# Altium schematic sheet CW342_FPGA_PWR.SchDoc: <Enter Sheet Title>
size Letter; Organization: NewAE Technology Inc.; Address1: 1083 Queen St., Suite 196; Address2: Halifax; Address3: NS; Address4: Canada B3H 0B2; SheetNumber: 8; SheetTotal: 9; SheetApproved: NO
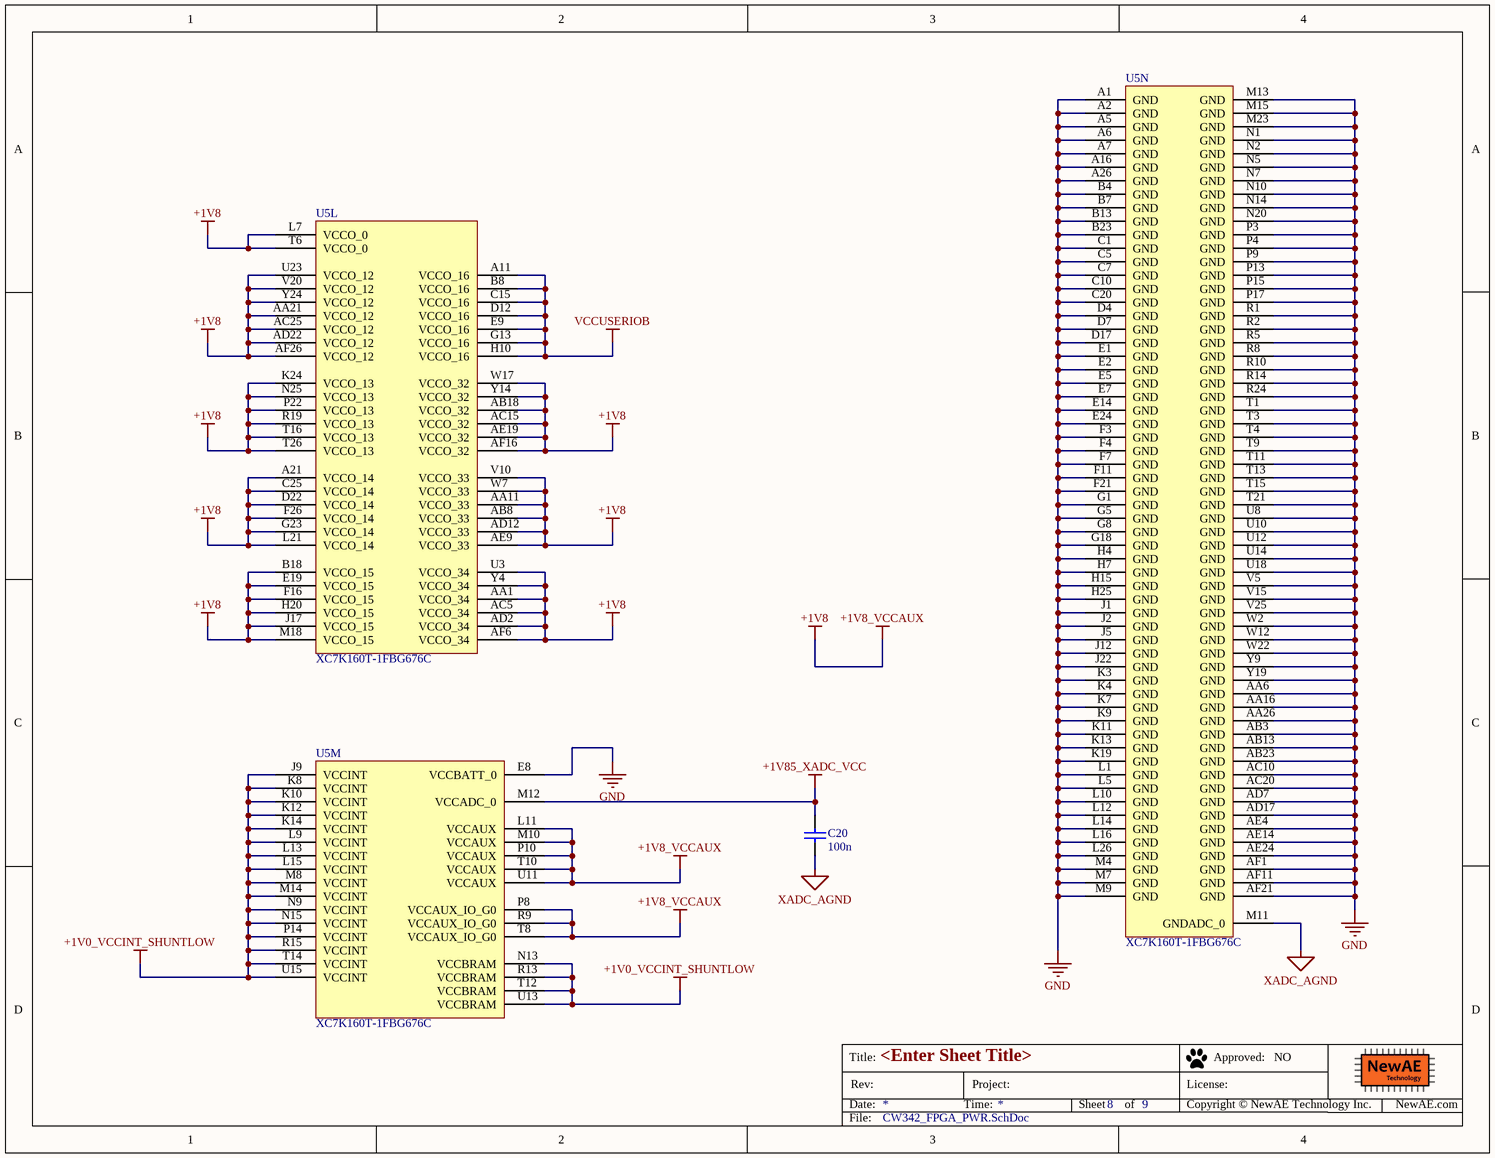
[diagram p0: CW342_FPGA_PWR.SchDoc]

## Parts
C20  100n  [CAPC0402_M]
U5  XC7K160T-1FBG676C  [FBG676]  (parts L,M,N of 14)

## Nets
+1V0_VCCINT_SHUNTLOW: U5.J9(VCCINT) U5.K8(VCCINT) U5.K10(VCCINT) U5.K12(VCCINT) U5.K14(VCCINT) U5.L9(VCCINT) U5.L13(VCCINT) U5.L15(VCCINT) U5.M8(VCCINT) U5.M14(VCCINT) U5.N9(VCCINT) U5.N13(VCCBRAM) U5.N15(VCCINT) U5.P14(VCCINT) U5.R13(VCCBRAM) U5.R15(VCCINT) U5.T12(VCCBRAM) U5.T14(VCCINT) U5.U13(VCCBRAM) U5.U15(VCCINT)
+1V8: U5.A21(VCCO_14) U5.AA1(VCCO_34) U5.AA11(VCCO_33) U5.AA21(VCCO_12) U5.AB8(VCCO_33) U5.AB18(VCCO_32) U5.AC5(VCCO_34) U5.AC15(VCCO_32) U5.AC25(VCCO_12) U5.AD2(VCCO_34) U5.AD12(VCCO_33) U5.AD22(VCCO_12) U5.AE9(VCCO_33) U5.AE19(VCCO_32) U5.AF6(VCCO_34) U5.AF16(VCCO_32) U5.AF26(VCCO_12) U5.B18(VCCO_15) U5.C25(VCCO_14) U5.D22(VCCO_14) U5.E19(VCCO_15) U5.F16(VCCO_15) U5.F26(VCCO_14) U5.G23(VCCO_14) U5.H20(VCCO_15) U5.J17(VCCO_15) U5.K24(VCCO_13) U5.L7(VCCO_0) U5.L11(VCCAUX) U5.L21(VCCO_14) U5.M10(VCCAUX) U5.M18(VCCO_15) U5.N25(VCCO_13) U5.P8(VCCAUX_IO_G0) U5.P10(VCCAUX) U5.P22(VCCO_13) U5.R9(VCCAUX_IO_G0) U5.R19(VCCO_13) U5.T6(VCCO_0) U5.T8(VCCAUX_IO_G0) U5.T10(VCCAUX) U5.T16(VCCO_13) U5.T26(VCCO_13) U5.U3(VCCO_34) U5.U11(VCCAUX) U5.U23(VCCO_12) U5.V10(VCCO_33) U5.V20(VCCO_12) U5.W7(VCCO_33) U5.W17(VCCO_32) U5.Y4(VCCO_34) U5.Y14(VCCO_32) U5.Y24(VCCO_12)  [also labelled +1V8_VCCAUX]
+1V85_XADC_VCC: C20.1 U5.M12(VCCADC_0)
GND: U5.A1(GND) U5.A2(GND) U5.A5(GND) U5.A6(GND) U5.A7(GND) U5.A16(GND) U5.A26(GND) U5.AA6(GND) U5.AA16(GND) U5.AA26(GND) U5.AB3(GND) U5.AB13(GND) U5.AB23(GND) U5.AC10(GND) U5.AC20(GND) U5.AD7(GND) U5.AD17(GND) U5.AE4(GND) U5.AE14(GND) U5.AE24(GND) U5.AF1(GND) U5.AF11(GND) U5.AF21(GND) U5.B4(GND) U5.B7(GND) U5.B13(GND) U5.B23(GND) U5.C1(GND) U5.C5(GND) U5.C7(GND) U5.C10(GND) U5.C20(GND) U5.D4(GND) U5.D7(GND) U5.D17(GND) U5.E1(GND) U5.E2(GND) U5.E5(GND) U5.E7(GND) U5.E8(VCCBATT_0) U5.E14(GND) U5.E24(GND) U5.F3(GND) U5.F4(GND) U5.F7(GND) U5.F11(GND) U5.F21(GND) U5.G1(GND) U5.G5(GND) U5.G8(GND) U5.G18(GND) U5.H4(GND) U5.H7(GND) U5.H15(GND) U5.H25(GND) U5.J1(GND) U5.J2(GND) U5.J5(GND) U5.J12(GND) U5.J22(GND) U5.K3(GND) U5.K4(GND) U5.K7(GND) U5.K9(GND) U5.K11(GND) U5.K13(GND) U5.K19(GND) U5.L1(GND) U5.L5(GND) U5.L10(GND) U5.L12(GND) U5.L14(GND) U5.L16(GND) U5.L26(GND) U5.M4(GND) U5.M7(GND) U5.M9(GND) U5.M13(GND) U5.M15(GND) U5.M23(GND) U5.N1(GND) U5.N2(GND) U5.N5(GND) U5.N7(GND) U5.N10(GND) U5.N14(GND) U5.N20(GND) U5.P3(GND) U5.P4(GND) U5.P9(GND) U5.P13(GND) U5.P15(GND) U5.P17(GND) U5.R1(GND) U5.R2(GND) U5.R5(GND) U5.R8(GND) U5.R10(GND) U5.R14(GND) U5.R24(GND) U5.T1(GND) U5.T3(GND) U5.T4(GND) U5.T9(GND) U5.T11(GND) U5.T13(GND) U5.T15(GND) U5.T21(GND) U5.U8(GND) U5.U10(GND) U5.U12(GND) U5.U14(GND) U5.U18(GND) U5.V5(GND) U5.V15(GND) U5.V25(GND) U5.W2(GND) U5.W12(GND) U5.W22(GND) U5.Y9(GND) U5.Y19(GND)
VCCUSERIOB: U5.A11(VCCO_16) U5.B8(VCCO_16) U5.C15(VCCO_16) U5.D12(VCCO_16) U5.E9(VCCO_16) U5.G13(VCCO_16) U5.H10(VCCO_16)
XADC_AGND: C20.2 U5.M11(GNDADC_0)

## Notes on the sheet
- Title:
- Date:
- Rev:
- Time:
- Project:
- Sheet
- of
- License:
- Copyright © NewAE Technology Inc.
- Approved:
- NewAE.com
- File:

## Library data of the parts
C20 = CCHIP-100n-0402: 100n, 0402; Manufacture Part Number 1: CGA2B3X7R1V104K050BB; Component Group: Capacitor; Case-EIA: 0402; Part Number: CCHIP-100n-0402; Footprint: 0402; Pin Count: 2; Value: 100n; Mounting Technology: SMT; Component Kind: Standard; Component Type: Standard; Supplier 1: Digi-Key; Supplier Part Number 1: 445-6901-1-ND
U5 = CMP-0361-00025-2: Kintex-7 FPGA, 400 User I/Os, 8 GTX, 676-Ball BGA, Speed Grade 1, Commercial Grade, Pb-Free; Manufacturer: Xilinx; SelectIO HR: 250; GTX: 8; SelectIO HP: 150; Speed Grade: -1; RoHS: Pb-Free; PackageReference: FBG676; Code_JEDEC: MS-034; Mounting Technology: Surface Mount; ComponentLink1URL: http://www.xilinx.com/support/documentation/data_sheets/ds180_7Series_Overview.pdf; DatasheetVersion: v1.12; Generic Part Number: XC7K160T; PartNumber: XC7K160T-1FBG676C; PackageVersion: Rev 1.8; ComponentLink2URL: http://www.xilinx.com/support/documentation/user_guides/ug475_7Series_Pkg_Pinout.pdf; PackageDescription: Flip-Chip Lidless BGA, Body 27 x 27 mm, 1.0 mm Pitch; ComponentLink1Description: Datasheet; ComponentLink2Description: Package Specification